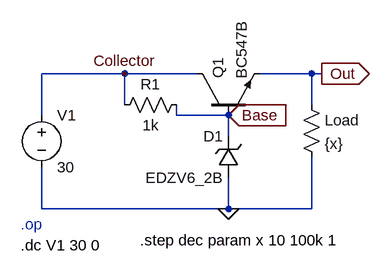
[diagram p0: schematic Basic Voltage Regulator.asc]
Basic Voltage Regulator.asc, the LTspice schematic file:
Version 4
SHEET 1 880 680
WIRE 144 80 16 80
WIRE 256 80 144 80
WIRE 432 80 352 80
WIRE 448 80 432 80
WIRE 144 128 144 80
WIRE 432 128 432 80
WIRE 16 144 16 80
WIRE 224 144 224 128
WIRE 304 144 224 144
WIRE 304 176 304 144
WIRE 16 288 16 224
WIRE 304 288 304 240
WIRE 304 288 16 288
WIRE 432 288 432 208
WIRE 432 288 304 288
FLAG 304 288 0
FLAG 448 80 Out
IOPIN 448 80 Out
FLAG 144 80 Collector
FLAG 304 144 Base
IOPIN 304 144 In
SYMBOL voltage 16 128 R0
WINDOW 123 0 0 Left 0
WINDOW 39 0 0 Left 0
SYMATTR InstName V1
SYMATTR Value 30
SYMBOL res 240 112 R90
WINDOW 0 0 56 VBottom 2
WINDOW 3 32 56 VTop 2
SYMATTR InstName R1
SYMATTR Value 1k
SYMBOL npn 256 144 R270
SYMATTR InstName Q1
SYMATTR Value BC547B
SYMBOL zener 320 240 R180
WINDOW 0 24 64 Left 2
WINDOW 3 24 0 Left 2
SYMATTR InstName D1
SYMATTR Value EDZV6_2B
SYMATTR Description Diode
SYMATTR Type diode
SYMBOL res 416 112 R0
SYMATTR InstName Load
SYMATTR Value {x}
TEXT -16 312 Left 2 ;.op
TEXT -16 344 Left 2 !.dc V1 30 0
TEXT 168 336 Left 2 !.step dec param x 10 100k 1

The netlist it stands for:
* Basic Voltage Regulator.asc
V1 Collector 0 30
R1 Base Collector 1k
Q1 Collector Base Out 0 BC547B
D1 0 Base EDZV6_2B
R§Load Out 0 {x}
.model D D
.lib standard.dio
.model NPN NPN
.model PNP PNP
.lib standard.bjt
* .op
.dc V1 30 0
.step dec param x 10 100k 1
.backanno
.end